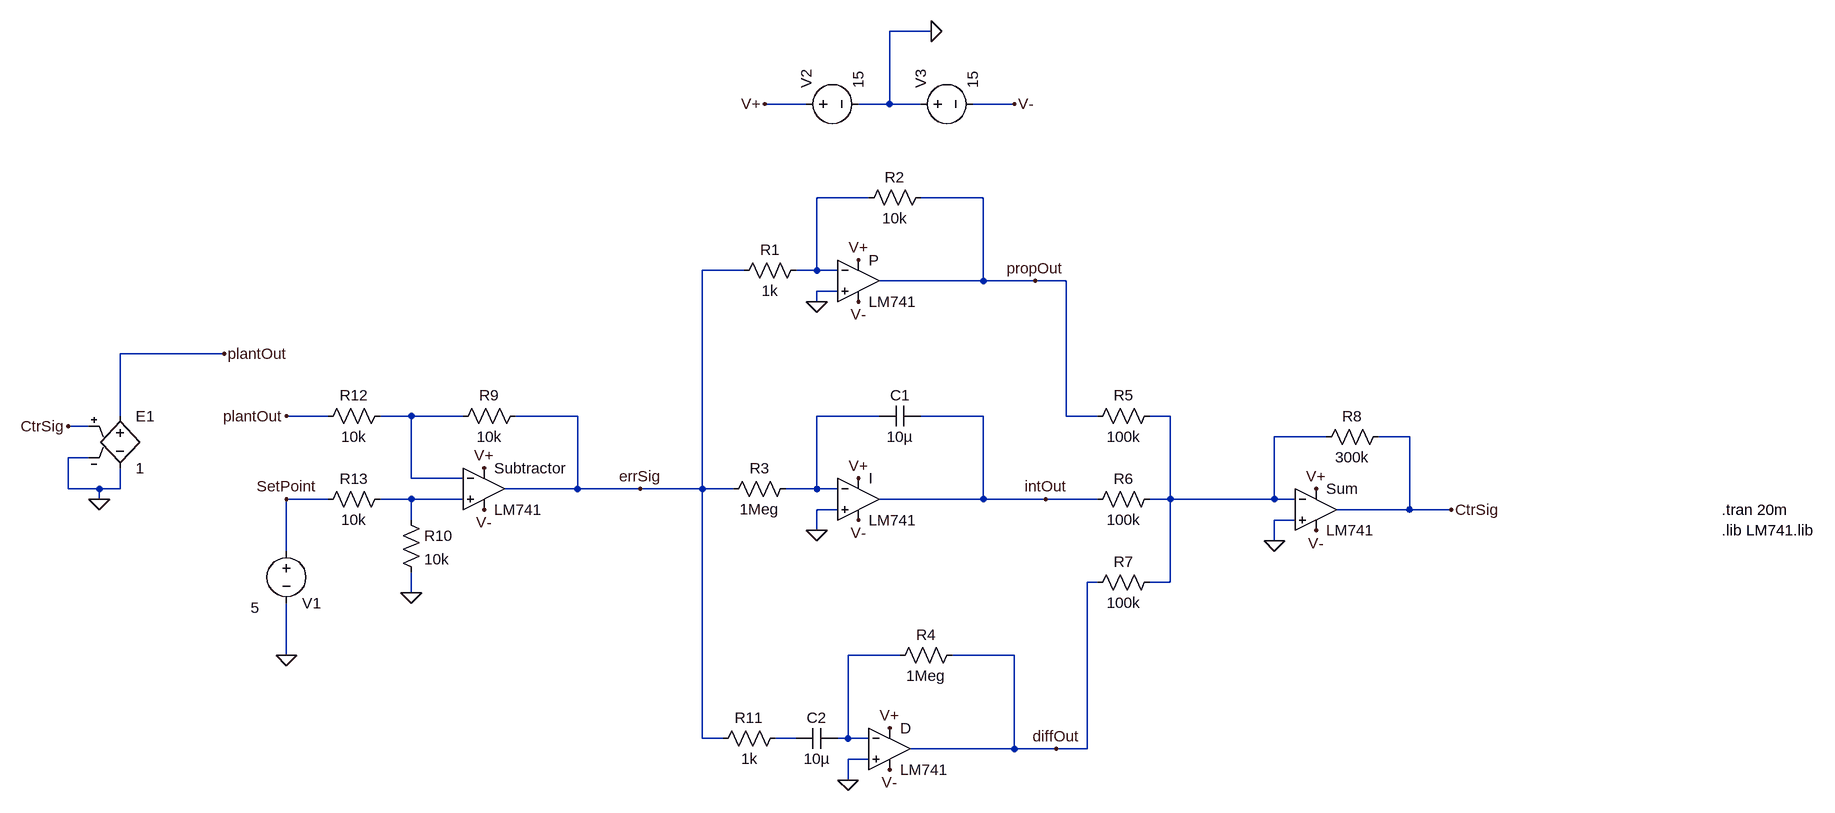
[diagram p0: schematic PID_controller.asc]
PID_controller.asc, the LTspice schematic file:
Version 4
SHEET 1 2512 1028
WIRE 320 -480 256 -480
WIRE 128 -368 64 -368
WIRE 256 -368 256 -480
WIRE 256 -368 208 -368
WIRE 304 -368 256 -368
WIRE 448 -368 384 -368
WIRE 224 -224 144 -224
WIRE 400 -224 304 -224
WIRE 32 -112 -32 -112
WIRE 144 -112 144 -224
WIRE 144 -112 112 -112
WIRE 176 -112 144 -112
WIRE 400 -96 400 -224
WIRE 400 -96 240 -96
WIRE 480 -96 400 -96
WIRE 528 -96 480 -96
WIRE 176 -80 144 -80
WIRE 144 -64 144 -80
WIRE -768 16 -928 16
WIRE -928 112 -928 16
WIRE -608 112 -672 112
WIRE -480 112 -528 112
WIRE -400 112 -480 112
WIRE -224 112 -320 112
WIRE 240 112 144 112
WIRE 400 112 304 112
WIRE 528 112 528 -96
WIRE 576 112 528 112
WIRE 688 112 656 112
WIRE -976 128 -1008 128
WIRE 928 144 848 144
WIRE 1056 144 1008 144
WIRE -976 176 -1008 176
WIRE -480 208 -480 112
WIRE -400 208 -480 208
WIRE -1008 224 -1008 176
WIRE -960 224 -1008 224
WIRE -928 224 -928 192
WIRE -928 224 -960 224
WIRE -224 224 -224 112
WIRE -224 224 -336 224
WIRE -128 224 -224 224
WIRE -32 224 -32 -112
WIRE -32 224 -128 224
WIRE 16 224 -32 224
WIRE 144 224 144 112
WIRE 144 224 96 224
WIRE 176 224 144 224
WIRE -960 240 -960 224
WIRE -608 240 -672 240
WIRE -480 240 -528 240
WIRE -400 240 -480 240
WIRE 400 240 400 112
WIRE 400 240 240 240
WIRE 496 240 400 240
WIRE 576 240 496 240
WIRE 688 240 688 112
WIRE 688 240 656 240
WIRE 848 240 848 144
WIRE 848 240 688 240
WIRE 880 240 848 240
WIRE 176 256 144 256
WIRE 1056 256 1056 144
WIRE 1056 256 944 256
WIRE 1120 256 1056 256
WIRE -480 272 -480 240
WIRE 880 272 848 272
WIRE 144 288 144 256
WIRE 848 304 848 272
WIRE -672 320 -672 240
WIRE 576 368 560 368
WIRE 688 368 688 240
WIRE 688 368 656 368
WIRE -480 384 -480 352
WIRE -672 480 -672 400
WIRE 272 480 192 480
WIRE 448 480 352 480
WIRE -32 608 -32 224
WIRE 0 608 -32 608
WIRE 112 608 80 608
WIRE 192 608 192 480
WIRE 192 608 176 608
WIRE 224 608 192 608
WIRE 448 624 448 480
WIRE 448 624 288 624
WIRE 512 624 448 624
WIRE 560 624 560 368
WIRE 560 624 512 624
WIRE 224 640 192 640
WIRE 192 672 192 640
FLAG 144 -64 0
FLAG 144 288 0
FLAG 192 672 0
FLAG 848 304 0
FLAG 64 -368 V+
FLAG 448 -368 V-
FLAG 912 288 V-
FLAG 256 656 V-
FLAG 208 272 V-
FLAG 208 -64 V-
FLAG 912 224 V+
FLAG 256 592 V+
FLAG 208 208 V+
FLAG 208 -128 V+
FLAG 320 -480 0
FLAG -480 384 0
FLAG -368 192 V+
FLAG -368 256 V-
FLAG 1120 256 CtrSig
FLAG -672 480 0
FLAG -672 112 plantOut
FLAG -960 240 0
FLAG -1008 128 CtrSig
FLAG -768 16 plantOut
FLAG -672 240 SetPoint
FLAG -128 224 errSig
FLAG 480 -96 propOut
FLAG 496 240 intOut
FLAG 512 624 diffOut
SYMBOL res 128 -128 R90
WINDOW 0 0 56 VBottom 2
WINDOW 3 32 56 VTop 2
SYMATTR InstName R1
SYMATTR Value 1k
SYMBOL res 320 -240 R90
WINDOW 0 0 56 VBottom 2
WINDOW 3 32 56 VTop 2
SYMATTR InstName R2
SYMATTR Value 10k
SYMBOL res 112 208 R90
WINDOW 0 0 56 VBottom 2
WINDOW 3 32 56 VTop 2
SYMATTR InstName R3
SYMATTR Value 1Meg
SYMBOL res 368 464 R90
WINDOW 0 0 56 VBottom 2
WINDOW 3 32 56 VTop 2
SYMATTR InstName R4
SYMATTR Value 1Meg
SYMBOL cap 304 96 R90
WINDOW 0 0 32 VBottom 2
WINDOW 3 32 32 VTop 2
SYMATTR InstName C1
SYMATTR Value 10µ
SYMBOL cap 176 592 R90
WINDOW 0 0 32 VBottom 2
WINDOW 3 32 32 VTop 2
SYMATTR InstName C2
SYMATTR Value 10µ
SYMBOL res 672 96 R90
WINDOW 0 0 56 VBottom 2
WINDOW 3 32 56 VTop 2
SYMATTR InstName R5
SYMATTR Value 100k
SYMBOL res 672 224 R90
WINDOW 0 0 56 VBottom 2
WINDOW 3 32 56 VTop 2
SYMATTR InstName R6
SYMATTR Value 100k
SYMBOL res 672 352 R90
WINDOW 0 0 56 VBottom 2
WINDOW 3 32 56 VTop 2
SYMATTR InstName R7
SYMATTR Value 100k
SYMBOL res 1024 128 R90
WINDOW 0 0 56 VBottom 2
WINDOW 3 32 56 VTop 2
SYMATTR InstName R8
SYMATTR Value 300k
SYMBOL voltage 112 -368 R270
WINDOW 123 0 0 Left 0
WINDOW 39 0 0 Left 0
SYMATTR InstName V2
SYMATTR Value 15
SYMBOL voltage 288 -368 R270
WINDOW 123 0 0 Left 0
WINDOW 39 0 0 Left 0
SYMATTR InstName V3
SYMATTR Value 15
SYMBOL res 96 592 R90
WINDOW 0 0 56 VBottom 2
WINDOW 3 32 56 VTop 2
SYMATTR InstName R11
SYMATTR Value 1k
SYMBOL OpAmps\\opamp2 208 -160 R0
SYMATTR InstName P
SYMATTR Value LM741
SYMBOL OpAmps\\opamp2 208 176 R0
SYMATTR InstName I
SYMATTR Value LM741
SYMBOL OpAmps\\opamp2 256 560 R0
SYMATTR InstName D
SYMATTR Value LM741
SYMBOL OpAmps\\opamp2 912 192 R0
SYMATTR InstName Sum
SYMATTR Value LM741
SYMBOL OpAmps\\opamp2 -368 160 R0
SYMATTR InstName Subtractor
SYMATTR Value LM741
SYMBOL res -304 96 R90
WINDOW 0 0 56 VBottom 2
WINDOW 3 32 56 VTop 2
SYMATTR InstName R9
SYMATTR Value 10k
SYMBOL res -496 256 R0
SYMATTR InstName R10
SYMATTR Value 10k
SYMBOL res -512 96 R90
WINDOW 0 0 56 VBottom 2
WINDOW 3 32 56 VTop 2
SYMATTR InstName R12
SYMATTR Value 10k
SYMBOL res -512 224 R90
WINDOW 0 0 56 VBottom 2
WINDOW 3 32 56 VTop 2
SYMATTR InstName R13
SYMATTR Value 10k
SYMBOL voltage -672 304 R0
WINDOW 0 24 96 Left 2
WINDOW 3 -55 103 Left 2
WINDOW 123 0 0 Left 0
WINDOW 39 0 0 Left 0
SYMATTR InstName V1
SYMATTR Value 5
SYMBOL e -928 96 R0
SYMATTR InstName E1
SYMATTR Value 1
TEXT 1536 256 Left 2 !.tran 20m
TEXT 1536 288 Left 2 !.lib LM741.lib

The netlist it stands for:
* PID_controller.asc
R1 N001 errSig 1k
R2 propOut N001 10k
R3 N003 errSig 1Meg
R4 diffOut N006 1Meg
C1 intOut N003 10µ
C2 N006 N007 10µ
R5 N004 propOut 100k
R6 N004 intOut 100k
R7 N004 diffOut 100k
R8 CtrSig N004 300k
V2 V+ 0 15
V3 0 V- 15
R11 N007 errSig 1k
XP 0 N001 V+ V- propOut LM741  ; pins In+ In- V+ V- OUT
XI 0 N003 V+ V- intOut LM741  ; pins In+ In- V+ V- OUT
XD 0 N006 V+ V- diffOut LM741  ; pins In+ In- V+ V- OUT
XSum 0 N004 V+ V- CtrSig LM741  ; pins In+ In- V+ V- OUT
XSubtractor N005 N002 V+ V- errSig LM741  ; pins In+ In- V+ V- OUT
R9 errSig N002 10k
R10 N005 0 10k
R12 N002 plantOut 10k
R13 N005 SetPoint 10k
V1 SetPoint 0 5
E1 plantOut 0 CtrSig 0 1
.tran 20m
.lib LM741.lib
.backanno
.end